# EAGLE schematic ledmatrixdrive_schematic (EAGLE 6.5.0)
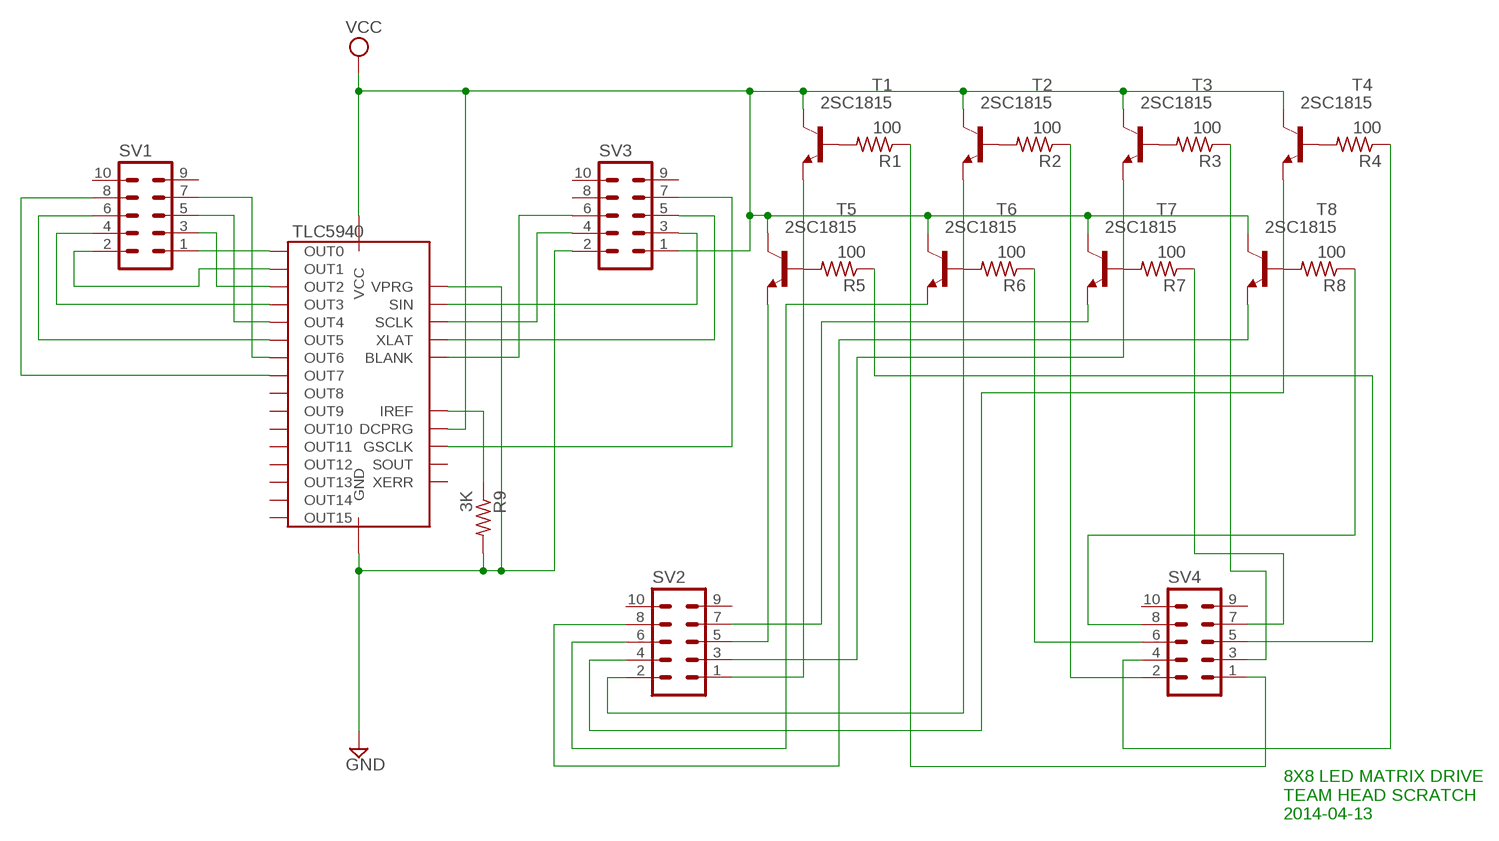
[diagram p0: schematic, sheet 1]

## Parts
R1  100  R-US_0204/5  [0204/5]
R2  100  R-US_0204/5  [0204/5]
R3  100  R-US_0204/5  [0204/5]
R4  100  R-US_0204/5  [0204/5]
R5  100  R-US_0204/5  [0204/5]
R6  100  R-US_0204/5  [0204/5]
R7  100  R-US_0204/5  [0204/5]
R8  100  R-US_0204/5  [0204/5]
R9  3K  R-US_0204/5  [0204/5]
SV1  ML10L  [ML10L]
SV2  ML10L  [ML10L]
SV3  ML10L  [ML10L]
SV4  ML10L  [ML10L]
T1  2SC1815  [TO92-ECB]
T2  2SC1815  [TO92-ECB]
T3  2SC1815  [TO92-ECB]
T4  2SC1815  [TO92-ECB]
T5  2SC1815  [TO92-ECB]
T6  2SC1815  [TO92-ECB]
T7  2SC1815  [TO92-ECB]
T8  2SC1815  [TO92-ECB]
TLC5940  IC-PACKAGE_DIL28  [IC-PACKAGE_DIL28-6]

## Nets
GND: R9.2 SV3.2 TLC5940.22(GND) TLC5940.27(VPRG)
N$1: R9.1 TLC5940.20(IREF)
N$2: SV1.1 TLC5940.28(OUT0)
N$3: SV1.2 TLC5940.1(OUT1)
N$4: SV1.3 TLC5940.2(OUT2)
N$5: SV1.4 TLC5940.3(OUT3)
N$6: SV1.5 TLC5940.4(OUT4)
N$7: SV1.6 TLC5940.5(OUT5)
N$8: SV1.7 TLC5940.6(OUT6)
N$9: SV1.8 TLC5940.7(OUT7)
N$10: SV3.3 TLC5940.26(SIN)
N$11: SV3.4 TLC5940.25(SCLK)
N$12: SV3.5 TLC5940.24(XLAT)
N$13: SV3.6 TLC5940.23(BLANK)
N$14: SV3.7 TLC5940.18(GSCLK)
N$15: R1.2 T1.B
N$16: R2.2 T2.B
N$17: R3.2 T3.B
N$18: R4.2 T4.B
N$19: R5.2 T5.B
N$20: R6.2 T6.B
N$21: R7.2 T7.B
N$22: R8.2 T8.B
N$23: SV2.1 T1.E
N$24: SV2.3 T3.E
N$25: SV2.5 T5.E
N$26: SV2.7 T7.E
N$27: SV2.2 T2.E
N$28: SV2.4 T4.E
N$29: SV2.6 T6.E
N$30: SV2.8 T8.E
N$31: R1.1 SV4.1
N$32: R2.1 SV4.2
N$33: R3.1 SV4.3
N$34: R4.1 SV4.4
N$35: R5.1 SV4.5
N$36: R6.1 SV4.6
N$37: R7.1 SV4.7
N$38: R8.1 SV4.8
VCC: SV3.1 T1.C T2.C T3.C T4.C T5.C T6.C T7.C T8.C TLC5940.19(DCPRG) TLC5940.21(VCC)
Unconnected: SV1.9 SV1.10 SV2.9 SV2.10 SV3.8 SV3.9 SV3.10 SV4.9 SV4.10 TLC5940.8(OUT8) TLC5940.9(OUT9) TLC5940.10(OUT10) TLC5940.11(OUT11) TLC5940.12(OUT12) TLC5940.13(OUT13) TLC5940.14(OUT14) TLC5940.15(OUT15) TLC5940.16(XERR) TLC5940.17(SOUT)

## Notes on the sheet
- 8X8 LED MATRIX DRIVE
  TEAM HEAD SCRATCH
  2014-04-13

## Library data of the parts
R1-R9 = rcl:R-US_: RESISTOR, American symbol
SV1-SV4 = con-ml:ML10L: HARTING; OC_FARNELL: unknown; OC_NEWARK: unknown
T1-T8 = transistor:2SC1815: NPN EPITAXIAL TRANSISTOR Source: TOSHIBA .. 2SC1815 1.pdf
TLC5940 = TLC5940:IC-PACKAGE_DIL28: Dual In Line